# EAGLE schematic 2.Soru (EAGLE 9.6.2)
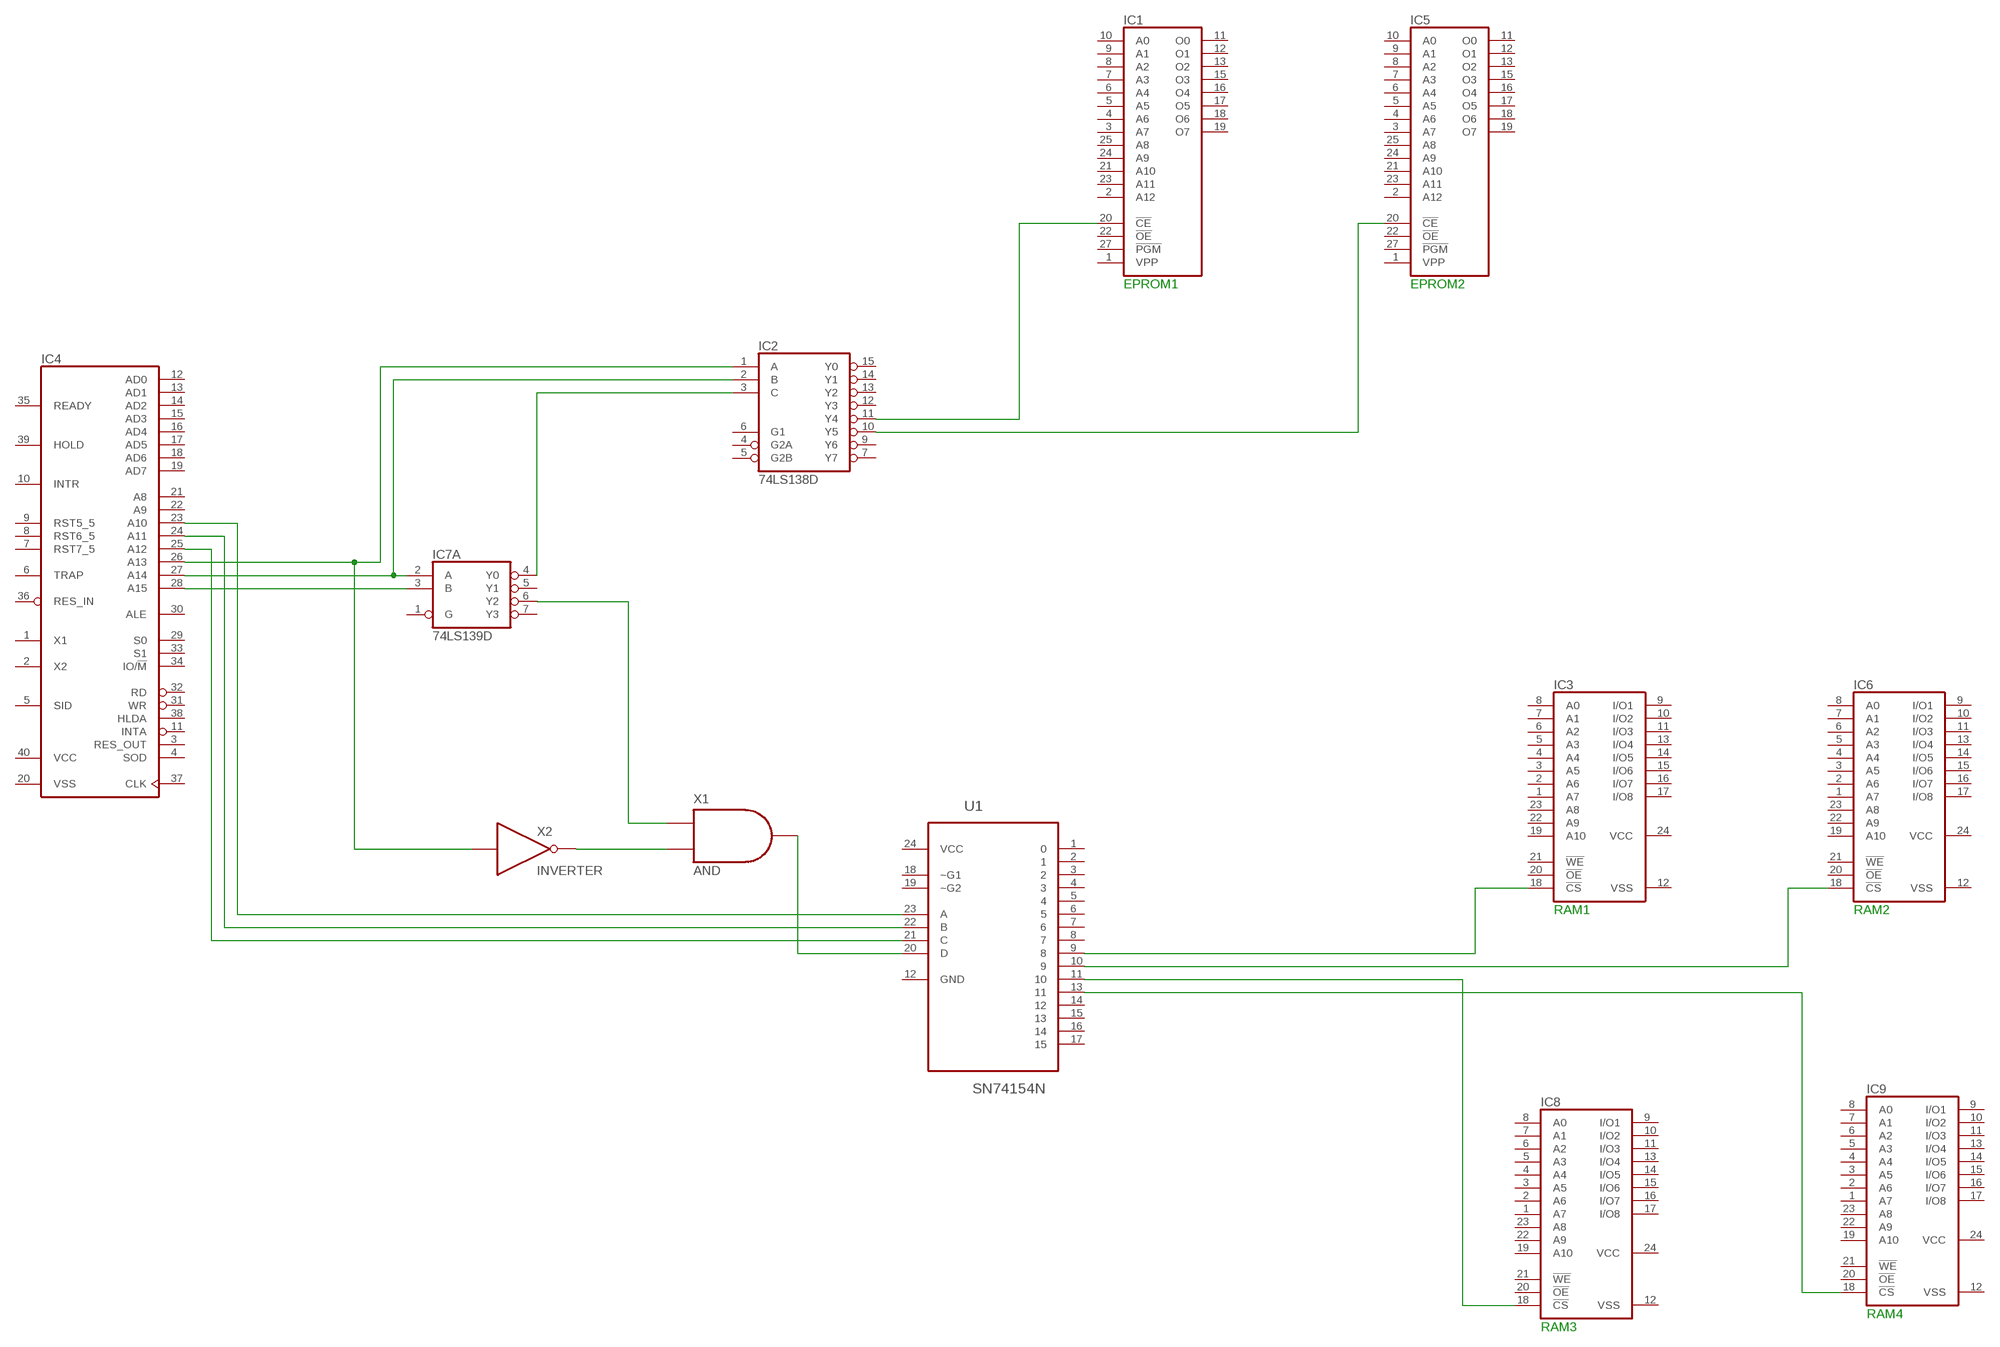
[diagram p0: schematic, sheet 1]

## Parts
IC1  2764  [DIL28]
IC2  74LS138D  [SO16]
IC3  6716P  [DIL24-3]
IC4  8085  [DIL40]
IC5  2764  [DIL28]
IC6  6716P  [DIL24-3]
IC7  74LS139D  [SO16]
IC8  6716P  [DIL24-3]
IC9  6716P  [DIL24-3]
U1  SN74154N  [DIP254P1080X508-24]
X1  AND  (no package)
X2  INVERTER  (no package)

## Nets
N$1: IC4.28(A15) IC7.3(A:B)
N$2: IC2.2(B) IC4.27(A14) IC7.2(A:A)
N$3: IC2.3(C) IC7.4(A:Y0)
N$4: IC2.1(A) IC4.26(A13) X2.I
N$5: IC7.6(A:Y2) X1.A
N$6: IC4.25(A12) U1.21(C)
N$7: IC4.24(A11) U1.22(B)
N$8: IC4.23(A10) U1.23(A)
N$9: X1.B X2.O
N$10: U1.20(D) X1.Y
N$11: IC1.20(!CE) IC2.11(Y4)
N$12: IC2.10(Y5) IC5.20(!CE)
N$13: IC3.18(!CS) U1.9
N$14: IC6.18(!CS) U1.10
N$15: IC8.18(!CS) U1.11
N$16: IC9.18(!CS) U1.13
Unconnected: IC1.1(VPP) IC1.2(A12) IC1.3(A7) IC1.4(A6) IC1.5(A5) IC1.6(A4) IC1.7(A3) IC1.8(A2) IC1.9(A1) IC1.10(A0) IC1.11(O0) IC1.12(O1) IC1.13(O2) IC1.15(O3) IC1.16(O4) IC1.17(O5) IC1.18(O6) IC1.19(O7) IC1.21(A10) IC1.22(!OE) IC1.23(A11) IC1.24(A9) IC1.25(A8) IC1.27(!PGM) IC2.4(G2A) IC2.5(G2B) IC2.6(G1) IC2.7(Y7) IC2.9(Y6) IC2.12(Y3) IC2.13(Y2) IC2.14(Y1) IC2.15(Y0) IC3.1(A7) IC3.2(A6) IC3.3(A5) IC3.4(A4) IC3.5(A3) IC3.6(A2) IC3.7(A1) IC3.8(A0) IC3.9(I/O1) IC3.10(I/O2) IC3.11(I/O3) IC3.13(I/O4) IC3.14(I/O5) IC3.15(I/O6) IC3.16(I/O7) IC3.17(I/O8) IC3.19(A10) IC3.20(!OE) IC3.21(!WE) IC3.22(A9) IC3.23(A8) IC4.1(X1) IC4.2(X2) IC4.3(RES_OUT) IC4.4(SOD) IC4.5(SID) IC4.6(TRAP) IC4.7(RST7_5) IC4.8(RST6_5) IC4.9(RST5_5) IC4.10(INTR) IC4.11(INTA) IC4.12(AD0) IC4.13(AD1) IC4.14(AD2) IC4.15(AD3) IC4.16(AD4) IC4.17(AD5) IC4.18(AD6) IC4.19(AD7) IC4.21(A8) IC4.22(A9) IC4.29(S0) IC4.30(ALE) IC4.31(WR) IC4.32(RD) IC4.33(S1) IC4.34(IO/!M) IC4.35(READY) IC4.36(RES_IN) IC4.37(CLK) IC4.38(HLDA) IC4.39(HOLD) IC5.1(VPP) IC5.2(A12) IC5.3(A7) IC5.4(A6) IC5.5(A5) IC5.6(A4) IC5.7(A3) IC5.8(A2) IC5.9(A1) IC5.10(A0) IC5.11(O0) IC5.12(O1) IC5.13(O2) IC5.15(O3) IC5.16(O4) IC5.17(O5) IC5.18(O6) IC5.19(O7) IC5.21(A10) IC5.22(!OE) IC5.23(A11) IC5.24(A9) IC5.25(A8) IC5.27(!PGM) IC6.1(A7) IC6.2(A6) IC6.3(A5) IC6.4(A4) IC6.5(A3) IC6.6(A2) IC6.7(A1) IC6.8(A0) IC6.9(I/O1) IC6.10(I/O2) IC6.11(I/O3) IC6.13(I/O4) IC6.14(I/O5) IC6.15(I/O6) IC6.16(I/O7) IC6.17(I/O8) IC6.19(A10) IC6.20(!OE) IC6.21(!WE) IC6.22(A9) IC6.23(A8) IC7.1(A:G) IC7.5(A:Y1) IC7.7(A:Y3) IC7.9(B:Y3) IC7.10(B:Y2) IC7.11(B:Y1) IC7.12(B:Y0) IC7.13(B:B) IC7.14(B:A) IC7.15(B:G) IC8.1(A7) IC8.2(A6) IC8.3(A5) IC8.4(A4) IC8.5(A3) IC8.6(A2) IC8.7(A1) IC8.8(A0) IC8.9(I/O1) IC8.10(I/O2) IC8.11(I/O3) IC8.13(I/O4) IC8.14(I/O5) IC8.15(I/O6) IC8.16(I/O7) IC8.17(I/O8) IC8.19(A10) IC8.20(!OE) IC8.21(!WE) IC8.22(A9) IC8.23(A8) IC9.1(A7) IC9.2(A6) IC9.3(A5) IC9.4(A4) IC9.5(A3) IC9.6(A2) IC9.7(A1) IC9.8(A0) IC9.9(I/O1) IC9.10(I/O2) IC9.11(I/O3) IC9.13(I/O4) IC9.14(I/O5) IC9.15(I/O6) IC9.16(I/O7) IC9.17(I/O8) IC9.19(A10) IC9.20(!OE) IC9.21(!WE) IC9.22(A9) IC9.23(A8) U1.1 U1.2 U1.3 U1.4 U1.5 U1.6 U1.7 U1.8 U1.12(GND) U1.14 U1.15 U1.16 U1.17 U1.18(~G1) U1.19(~G2)

## Notes on the sheet
- EPROM1 | EPROM2
- RAM1 | RAM2
- RAM4
- RAM3

## Power pins joined to a net without a drawn wire
GND: IC1.14(GND) IC2.8(GND) IC5.14(GND) IC7.8(P:GND)
VCC: IC1.28(VCC) IC2.16(VCC) IC3.24(VCC) IC4.40(VCC) IC5.28(VCC) IC6.24(VCC) IC7.16(P:VCC) IC8.24(VCC) IC9.24(VCC) U1.24(VCC)
VSS: IC3.12(VSS) IC4.20(VSS) IC6.12(VSS) IC8.12(VSS) IC9.12(VSS)

## Library data of the parts
IC1 IC5 = memory:2764: MEMORY
IC2 = 74xx-eu:74*138: 3-line to 8-line DECODER/DEMULTIPLEXER
IC3 IC6 IC8 IC9 = memory-hitachi:6716P: MEMORY; OC_FARNELL: unknown; OC_NEWARK: unknown
IC4 = micro-intel:8085: MICROCOMPUTER/PERIPHERAL DEVICE; OC_FARNELL: unknown; OC_NEWARK: unknown
IC7 = 74xx-eu:74*139: Dual 2-line to 4-line DECODER/DEMULTIPLEXER
U1 = SN74154N:SN74154N: DECODERS/DEMULTIPLEXERS Check availability <https://pricing.snapeda.com/parts/SN74154N/semi/view-part?ref=eda>; AVAILABILITY: Not in stock; CHECK_PRICES: https://www.snapeda.com/parts/SN74154N/Performance+Semiconductor/view-part/?ref=eda; DESCRIPTION: Encoders, Decoders, Multiplexers & Demultiplexers 4 to 16; MF: semi; MP: SN74154N; PACKAGE: None; PRICE: None; SNAPEDA_LINK: https://www.snapeda.com/parts/SN74154N/Performance+Semiconductor/view-part/?ref=snap
X1 = ngspice-digital:AND: 2 input logic AND gate
X2 = ngspice-digital:INVERTER: logic inverter (NOT gate)